# Altium schematic sheet Linx.SchDoc
size A
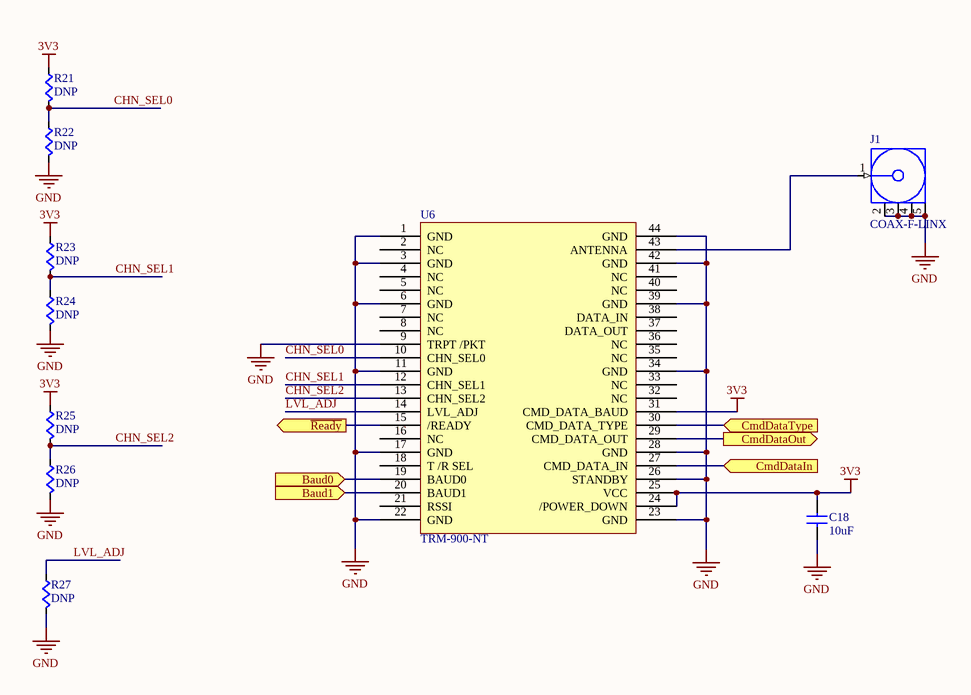
[diagram p0: Linx.SchDoc]

## Parts
C18  value 10uF  [CAPC0603]  (hidden comment: Cap)
J1  COAX-F-LINX  [MCX5.08-H5-EDITED]
R21  value DNP  [RES0603]  (hidden comment: Res)
R22  value DNP  [RES0603]  (hidden comment: Res)
R23  value DNP  [RES0603]  (hidden comment: Res)
R24  value DNP  [RES0603]  (hidden comment: Res)
R25  value DNP  [RES0603]  (hidden comment: Res)
R26  value DNP  [RES0603]  (hidden comment: Res)
R27  value DNP  [RES0603]  (hidden comment: Res)
U6  TRM-900-NT  [TRM-900-NT]

## Ports
Baud0 (in), Baud1 (in), CmdDataIn (in), CmdDataOut (out), CmdDataType (in), ~{Ready} (out)

## Nets
3V3: C18.1(A) R21.2(B) R23.2(B) R25.2(B) U6.24(/POWER_DOWN) U6.25(VCC) U6.31(CMD_DATA_BAUD)
GND: C18.2(B) J1.2(GND) J1.3(GND) J1.4(GND) J1.5(GND) R22.1(A) R24.1(A) R26.1(A) R27.1(A) U6.1(GND) U6.3(GND) U6.6(GND) U6.9(TRPT_/PKT) U6.11(GND) U6.17(GND) U6.22(GND) U6.23(GND) U6.26(STANDBY) U6.28(GND) U6.34(GND) U6.39(GND) U6.42(GND) U6.44(GND)
Baud0: U6.19(BAUD0) ; port Baud0
Baud1: U6.20(BAUD1) ; port Baud1
CHN_SEL0: R21.1(A) R22.2(B) U6.10(CHN_SEL0)
CHN_SEL1: R23.1(A) R24.2(B) U6.12(CHN_SEL1)
CHN_SEL2: R25.1(A) R26.2(B) U6.13(CHN_SEL2)
CmdDataIn: U6.27(CMD_DATA_IN) ; port CmdDataIn
CmdDataOut: U6.29(CMD_DATA_OUT) ; port CmdDataOut
CmdDataType: U6.30(CMD_DATA_TYPE) ; port CmdDataType
LVL_ADJ: R27.2(B) U6.14(LVL_ADJ)
~{Ready}: U6.15(/READY) ; port ~{Ready}
NetJ1_1: J1.1(Signal) U6.43(ANTENNA)

Not connected (* = marked no-connect by the designer): U6 2(NC) 4(NC) 5(NC) 7(NC) 8(NC) 16(NC) 18(T_/R_SEL) 21(RSSI) 32(NC) 33(NC) 35(NC) 36(NC) 37(DATA_OUT) 38(DATA_IN) 40(NC) 41(NC)

## Library data of the parts
J1 = COAX-F-LINX: RF Coaxial PCB Connector, MCX; Thru-Hole, Right-Angle Mount Socket, Blunt Post Terminal, 50 Ohm Impedance, Edited for 0.2mm larger holes; Supplier 1: Digi-Key; Supplier Part Number 1: *
U6 = TRM-900-NT: RF TXRX MODULE ISM<1GHZ; Manufacturer 1: Linx; Supplier 1: Digi-Key; Supplier Part Number 1: TRM-900-NT-ND; Manufacturer Part Number 1: TRM-900-NT
C18 = Cap: Supplier 1: Digi-Key; Supplier Part Number 1: 1276-1000-1-ND
R21-R27 = Res: Supplier 1: Digi-Key; Supplier Part Number 1: 311-0.0GRCT-ND